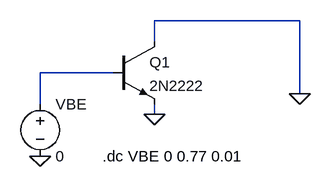
[diagram p0: schematic 003 TJB.asc]
003 TJB.asc, the LTspice schematic file:
Version 4
SHEET 1 880 680
WIRE 384 80 160 80
WIRE 160 112 160 80
WIRE 96 160 -16 160
WIRE 384 192 384 80
WIRE -16 208 -16 160
WIRE 160 224 160 208
FLAG -16 288 0
FLAG 160 224 0
FLAG 384 192 0
SYMBOL npn 96 112 R0
SYMATTR InstName Q1
SYMATTR Value 2N2222
SYMBOL voltage -16 192 R0
SYMATTR InstName VBE
SYMATTR Value 0
TEXT 80 288 Left 2 !.dc VBE 0 0.77 0.01

The netlist it stands for:
* 003 TJB.asc
Q1 0 N001 0 0 2N2222
VBE N001 0 0
.model NPN NPN
.model PNP PNP
.lib standard.bjt
.dc VBE 0 0.77 0.01
.backanno
.end